# Altium schematic sheet deepshark_inter_communication.SchDoc
size A4
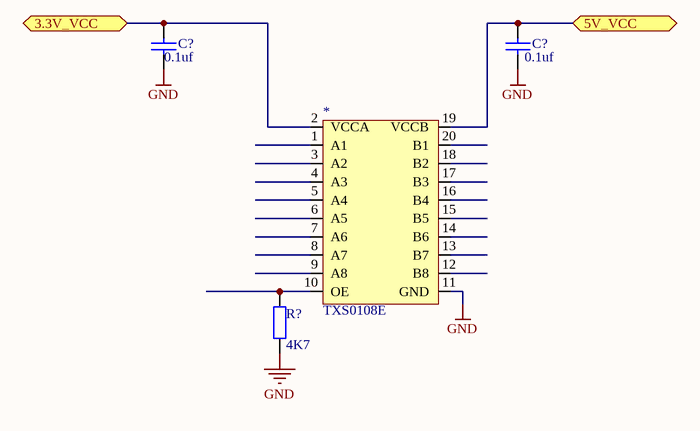
[diagram p0: deepshark_inter_communication.SchDoc]

## Parts
(Parts that share a designator on the sheet are numbered #1, #2 ... from top to bottom, then left to right.)
*  TXS0108E
C?#1  value 0.1uf  [RAD-0.3]  (hidden comment: Cap)
C?#2  value 0.1uf  [RAD-0.3]  (hidden comment: Cap)
R?  value 4K7  [AXIAL-0.4]  (hidden comment: Res2)

## Ports
3.3V_VCC, 5V_VCC

## Nets
GND: *.11(GND) C?#1.1 C?#2.1 R?.1
3.3V_VCC: *.2(VCCA) C?#1.2 ; port 3.3V_VCC
5V_VCC: *.19(VCCB) C?#2.2 ; port 5V_VCC
Net*_10: *.10(OE) R?.2

Not connected (* = marked no-connect by the designer): * 1(A1) 3(A2) 4(A3) 5(A4) 6(A5) 7(A6) 8(A7) 9(A8) 12(B8) 13(B7) 14(B6) 15(B5) 16(B4) 17(B3) 18(B2) 20(B1)

## Library data of the parts
C?#1 C?#2 = Cap: Capacitor; Published: 8-Jun-2000; LatestRevisionDate: 17-Jul-2002; LatestRevisionNote: Re-released for DXP Platform.; PackageReference: RAD-0.3; Publisher: Altium Limited; PackageDescription: Radial Cap, Thru-Hole; 2 Leads; 0.3 in Pin Spacing
R? = Res2: Resistor; Published: 8-Jun-2000; LatestRevisionDate: 17-Jul-2002; LatestRevisionNote: Re-released for DXP Platform.; PackageReference: AXIAL-0.4; Publisher: Altium Limited; PackageDescription: Axial Device, Thru-Hole; 2 Leads; 0.4 in Pin Spacing